# EAGLE schematic memoryModule (EAGLE 9.6.2)
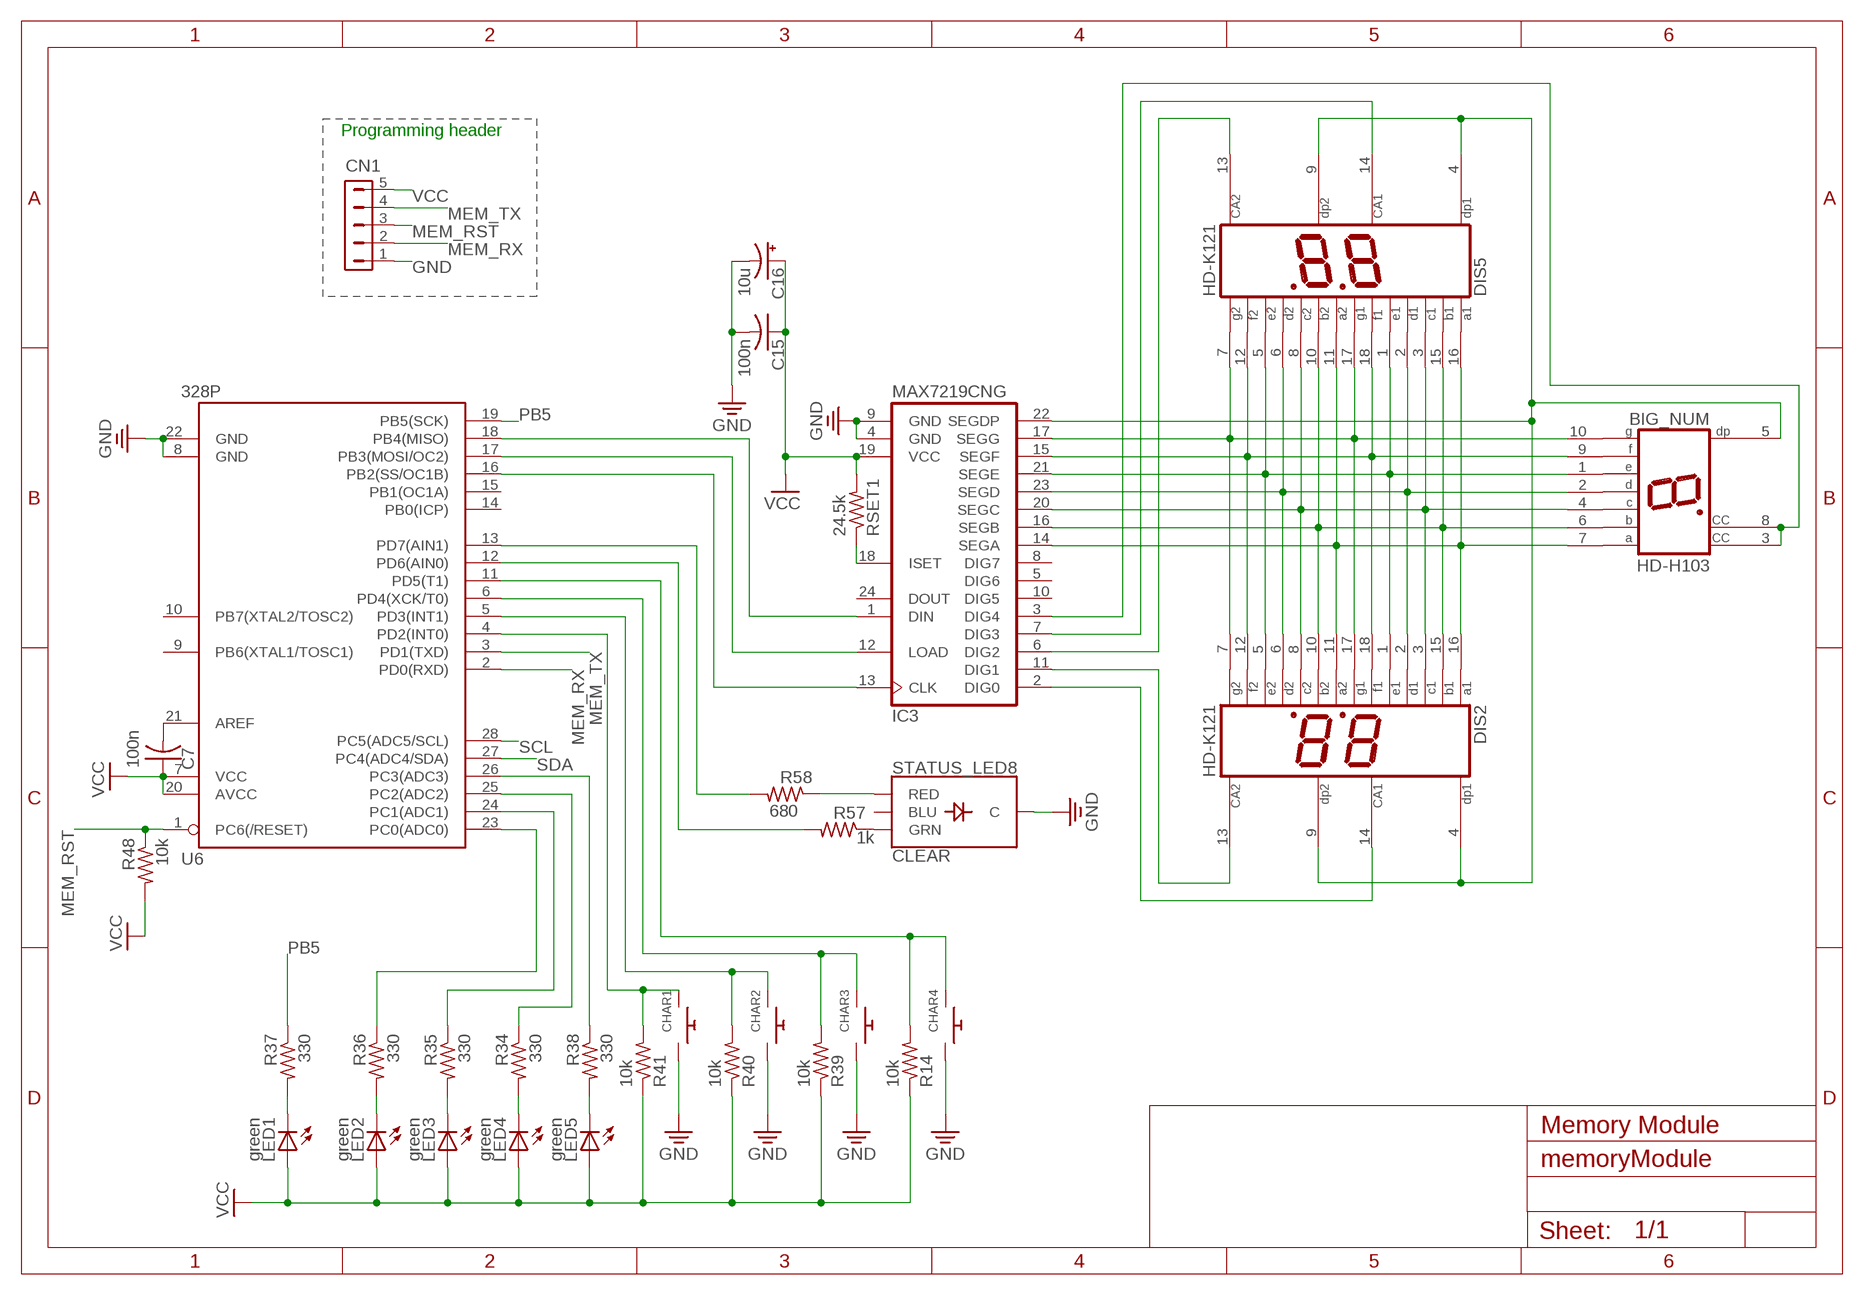
[diagram p0: schematic, sheet 1]

## Parts
BIG_NUM  HD-H103  [HDSP-M]
C7  100n  C-US025-024X044  [C025-024X044]
C15  100n  C-US025-024X044  [C025-024X044]
C16  10u  CPOL-US085CS-1AR  [085CS_1AR]
CHAR1  SWITCH_PUSHBUTTONEVQ-PE  [TACT_PANA-EVQ]
CHAR2  SWITCH_PUSHBUTTONEVQ-PE  [TACT_PANA-EVQ]
CHAR3  SWITCH_PUSHBUTTONEVQ-PE  [TACT_PANA-EVQ]
CHAR4  SWITCH_PUSHBUTTONEVQ-PE  [TACT_PANA-EVQ]
CN1  HDR-1X5-SIP-100  [SIP-100-5V]
DIS2  HD-K121  [HDSP-R]
DIS5  HD-K121  [HDSP-R]
IC3  MAX7219CNG  [DIL24-3]
LED1  green  LED5MM  [LED5MM]
LED2  green  LED5MM  [LED5MM]
LED3  green  LED5MM  [LED5MM]
LED4  green  LED5MM  [LED5MM]
LED5  green  LED5MM  [LED5MM]
R14  10k  R-US_0309/12  [0309/12]
R34  330  R-US_0309/12  [0309/12]
R35  330  R-US_0309/12  [0309/12]
R36  330  R-US_0309/12  [0309/12]
R37  330  R-US_0309/12  [0309/12]
R38  330  R-US_0309/12  [0309/12]
R39  10k  R-US_0309/12  [0309/12]
R40  10k  R-US_0309/12  [0309/12]
R41  10k  R-US_0309/12  [0309/12]
R48  10k  R-US_0309/12  [0309/12]
R57  1k  FLIPFLOP-RES  [0805-THM]
R58  680  FLIPFLOP-RES  [0805-THM]
RSET1  24.5k  R-US_0204/7  [0204/7]
STATUS_LED8  CLEAR  LED-RGB-CCCLEAR  [LED-RGB-THRU]
U6  328P  ATMEGA328P_PDIP  [DIP28]

## Nets
GND: C15.2 C16.- CHAR1.P$1 CHAR2.P$1 CHAR3.P$1 CHAR4.P$1 CN1.1 IC3.4(GND) IC3.9(GND) STATUS_LED8.2(C) U6.8(GND) U6.22(GND)
MEM_RST: CN1.3 R48.1 U6.1(PC6(/RESET))
MEM_RX: CN1.2 U6.2(PD0(RXD))
MEM_TX: CN1.4 U6.3(PD1(TXD))
N$91: BIG_NUM.7(A) DIS2.11(A2) DIS2.16(A1) DIS5.11(A2) DIS5.16(A1) IC3.14(SEGA)
N$92: BIG_NUM.6(B) DIS2.10(B2) DIS2.15(B1) DIS5.10(B2) DIS5.15(B1) IC3.16(SEGB)
N$93: BIG_NUM.4(C) DIS2.3(C1) DIS2.8(C2) DIS5.3(C1) DIS5.8(C2) IC3.20(SEGC)
N$94: BIG_NUM.2(D) DIS2.2(D1) DIS2.6(D2) DIS5.2(D1) DIS5.6(D2) IC3.23(SEGD)
N$95: BIG_NUM.1(E) DIS2.1(E1) DIS2.5(E2) DIS5.1(E1) DIS5.5(E2) IC3.21(SEGE)
N$96: BIG_NUM.9(F) DIS2.12(F2) DIS2.18(F1) DIS5.12(F2) DIS5.18(F1) IC3.15(SEGF)
N$97: BIG_NUM.10(G) DIS2.7(G2) DIS2.17(G1) DIS5.7(G2) DIS5.17(G1) IC3.17(SEGG)
N$98: BIG_NUM.5(DP) DIS2.4(DP1) DIS2.9(DP2) DIS5.4(DP1) DIS5.9(DP2) IC3.22(SEGDP)
N$99: R57.2 U6.12(PD6(AIN0))
N$100: R58.2 U6.13(PD7(AIN1))
N$101: DIS5.14(CA1) IC3.7(DIG3)
N$102: DIS5.13(CA2) IC3.6(DIG2)
N$103: DIS2.13(CA2) IC3.11(DIG1)
N$104: DIS2.14(CA1) IC3.2(DIG0)
N$105: LED1.K(C) R37.2
N$106: LED2.K(C) R36.2
N$107: C7.2 U6.21(AREF)
N$110: IC3.18(ISET) RSET1.1
N$111: LED3.K(C) R35.2
N$112: LED4.K(C) R34.2
N$113: LED5.K(C) R38.2
N$114: R35.1 R36.1 R38.1 U6.23(PC0(ADC0)) U6.24(PC1(ADC1)) U6.26(PC3(ADC3))
N$117: BIG_NUM.3(CC) BIG_NUM.8(CC) IC3.3(DIG4)
N$118: CHAR1.P$2 R41.2 U6.4(PD2(INT0))
N$119: IC3.13(CLK) U6.16(PB2(SS/OC1B))
N$120: CHAR3.P$2 R39.2 U6.6(PD4(XCK/T0))
N$121: CHAR4.P$2 R14.2 U6.11(PD5(T1))
N$134: R34.1 U6.25(PC2(ADC2))
N$135: IC3.12(LOAD) U6.17(PB3(MOSI/OC2))
N$136: CHAR2.P$2 R40.2 U6.5(PD3(INT1))
N$137: IC3.1(DIN) U6.18(PB4(MISO))
N$159: R57.1 STATUS_LED8.3(GRN)
N$160: R58.1 STATUS_LED8.1(RED)
PB5: R37.1 U6.19(PB5(SCK))
SCL: U6.28(PC5(ADC5/SCL))
SDA: U6.27(PC4(ADC4/SDA))
VCC: C7.1 C15.1 C16.+ CN1.5 IC3.19(VCC) LED1.A LED2.A LED3.A LED4.A LED5.A R14.1 R39.1 R40.1 R41.1 R48.2 RSET1.2 U6.7(VCC) U6.20(AVCC)
Unconnected: IC3.5(DIG6) IC3.8(DIG7) IC3.10(DIG5) IC3.24(DOUT) STATUS_LED8.4(BLU) U6.9(PB6(XTAL1/TOSC1)) U6.10(PB7(XTAL2/TOSC2)) U6.14(PB0(ICP)) U6.15(PB1(OC1A))

## Notes on the sheet
- Programming header
- Memory Module

## Library data of the parts
BIG_NUM = display-hp:HD-H103: LED DISPLAY 1-character 7 segment, decimal point right; OC_FARNELL: unknown; OC_NEWARK: unknown
C7 C15 = adafruit:C-US: CAPACITOR, American symbol
C16 = adafruit:CPOL-US: POLARIZED CAPACITOR, American symbol
CHAR1-CHAR4 = adafruit:SWITCH_PUSHBUTTON: Buttons SOFTTOUCHSMD_SJ - Soft touch temporary push button (Super Junk Akihabara) Compatible with SKPMANE010 [Mouser: 688-SKPMAN] C&K_KSS = Digikey: KSS221GLFS
CN1 = con-hdrs40:HDR-1X5: HEADER CONNECTOR
DIS2 DIS5 = display-hp:HD-K121: LED DISPLAY 2 x 1 character 7 segment, decimal points right; OC_FARNELL: unknown; OC_NEWARK: unknown
IC3 = maxim:MAX7219CNG: LED DISPLAY DRIVER; MF: MAXIM; MPN: MAX7219CNG; OC_FARNELL: 1523914; OC_NEWARK: 34C4018
LED1-LED5 = adafruit:LED: LED OSRAM: - CHIPLED LG R971, LG N971, LY N971, LG Q971, LY Q971, LO R971, LY R971 LH N974, LH R974 LS Q976, LO Q976, LY Q976 LO Q996 - Hyper CHIPLED LW Q18S LB Q993, LB Q99A, LB R99A - SideLED LS A670, LO A670, LY A670, LG A670, LP A670 LB A673, LV A673, LT A673, LW A673 LH A674 LY A675 LS A676, LA A676, LO A676, LY A676, LW A676 LS A679, LY A679, LG A679 - Hyper Micro SIDELED® LS Y876, LA Y876, LO Y876, LY Y876 LT Y87S - SmartLED LW L88C, LW L88S LB L89C, LB L89S, LG L890 LS L89K, LO L89K, LY L89K LS L896, LA L896, LO L896, LY L896 - TOPLED LS T670, LO T670, LY T670, LG T670, LP T670 LSG T670, LSP T670, LSY T670, LOP T670, LYG T670 LG T671, LOG T671, LSG T671 LB T673, LV T673, LT T673, LW T673 LH T674 LS T676, LA T676, LO T676, LY T676, LB T676, LH T676, LSB T676, LW T676 LB T67C, LV T67C, LT T67C, LS T67K, LO T67K, LY T67K, LW E67C LS E67B, LA E67B, LO E67B, LY E67B, LB E67C, LV E67C, LT E67C LW T67C LS T679, LY T679, LG T679 LS T770, LO T770, LY T770, LG T770, LP T770 LB T773, LV T773, LT T773, LW T773 LH T774 LS E675, LA E675, LY E675, LS T675 LS T776, LA T776, LO T776, LY T776, LB T776 LHGB T686 LT T68C, LB T68C - Hyper Mini TOPLED® LB M676 - Mini TOPLED Santana® LG M470 LS M47K, LO M47K, LY M47K Source: http://www.osram.convergy.de/
R14 R34-R41 R48 = adafruit:R-US_: RESISTOR, American symbol
R57 R58 = adafruit:FLIPFLOP-RES: Flip Flop resistor An 0805 resistor inside a standard 1/4W 5% resistor. Makes for easy mods
RSET1 = BeagleBone_Black_Wireless:R-US_: RESISTOR, American symbol
STATUS_LED8 = SparkFun-LED:LED-RGB-CC: LED-RGB Common Cathode Packages: LED RGB-THRU LED_PIRANHA_5MM SparkFun Products: RGB Diffused Common Cathode- Diffuse <[https://www.sparkfun.com/products/9264]> RGB Diffused Common Cathode - Clear <[https://www.sparkfun.com/products/105]> LED-RGB 5mm Square (Piranha) <[https://www.sparkfun.com/products/11679]>; PROD_ID: DIO-08418
U6 = SparkFun-IC-Microcontroller:ATMEGA328P_PDIP: Atmel 328P Through hole ATMEGA328P uC used in the Arduino 32kb flash, 1k EEPROM, 2k SRAM Datasheet <http://www.sparkfun.com/datasheets/Components/SMD/ATMega328.pdf> SparkFun Products Storefront component: AVR 28 Pin 20MHz 32K 6A/D - ATMega328P <https://www.sparkfun.com/products/9061> (COM-09061) SparkFun Simon Says - Through-Hole Soldering Kit <https://www.sparkfun.com/products/10547> (KIT-10547) SparkFun Learn to Solder - Simon Says <https://www.sparkfun.com/products/13708> (KIT-13708) SparkFun BigTime Watch Kit <https://www.sparkfun.com/products/11734> (KIT-11734) SparkFun ClockIt <https://www.sparkfun.com/products/10930> (KIT-10930) SparkFun Serial Enabled LCD Kit <https://www.sparkfun.com/products/10097> (LCD-10097) SparkFun Simon Tilts - Through Hole Soldering Kit <https://www.sparkfun.com/products/12634> (KIT-12634) SparkFun Frequency Counter Kit <https://www.sparkfun.com/products/10140> (KIT-10140) FabFM Radio Kit <https://www.sparkfun.com/products/11043> (KIT-11043) SparkFun Binary Blaster Kit <https://www.sparkfun.com/products/12037> (KIT-12037) SparkFun Metro-Gnome <https://www.sparkfun.com/products/9236> (KIT-09236) ATmega328 with Arduino Optiboot (Uno) <https://www.sparkfun.com/products/10524> (DEV-10524); PROD_ID: IC-09136